# Altium schematic sheet ATMEGA328P.SchDoc
size A; SheetNumber: 4; SheetTotal: 6
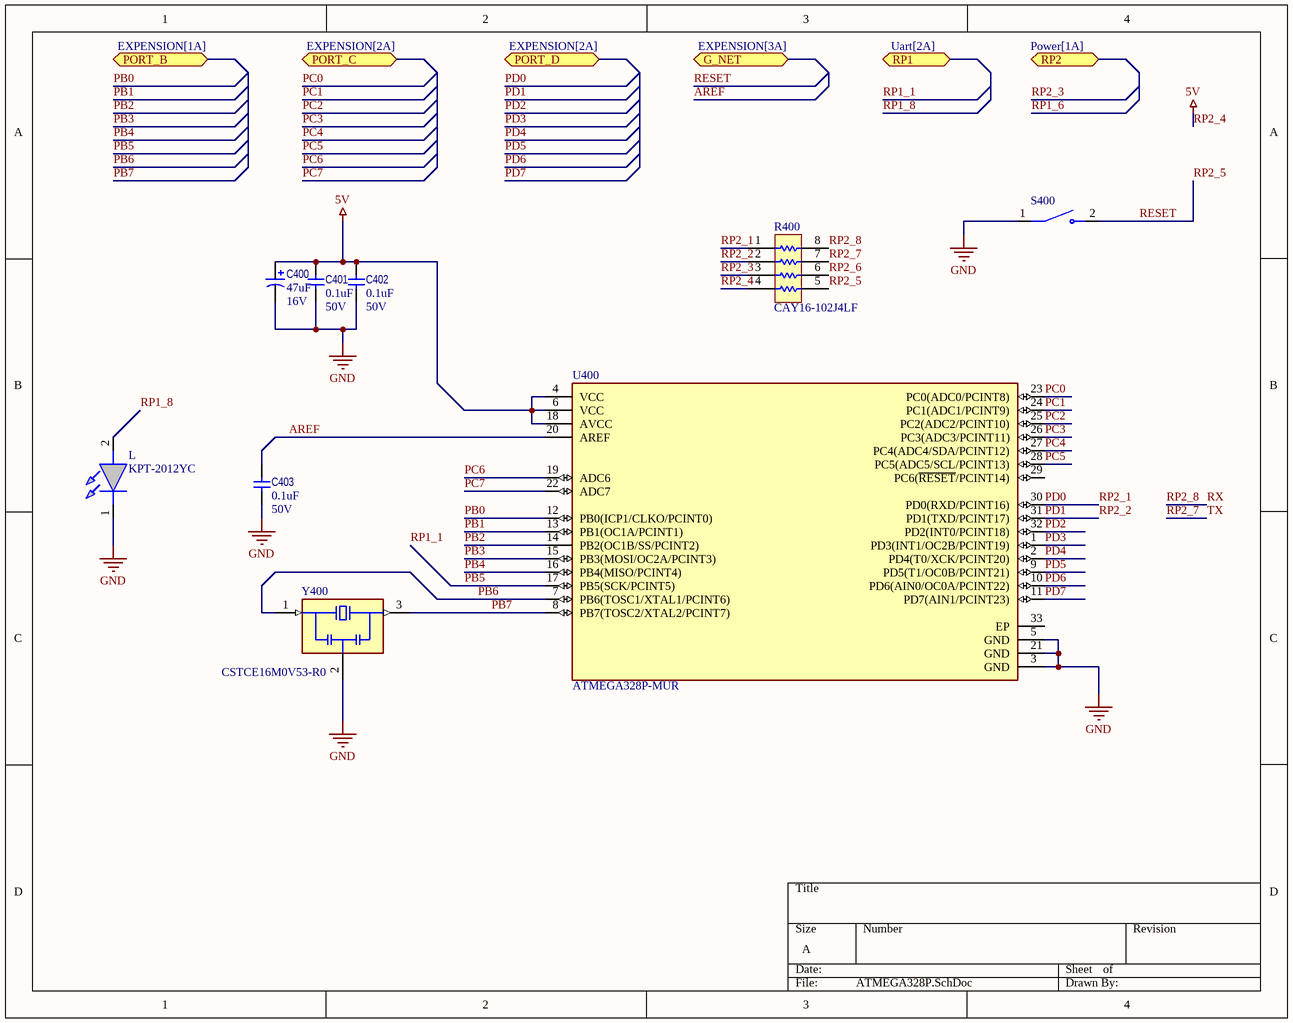
[diagram p0: ATMEGA328P.SchDoc]

## Parts
C400  Voltage_Rating: 16V  [CAPMP7343X430N]  (hidden comment: 47uF)
C401  Voltage_Rating: 50V  [CAPC1005X55N]  (hidden comment: 0.1uF)
C402  Voltage_Rating: 50V  [CAPC1005X55N]  (hidden comment: 0.1uF)
C403  Voltage_Rating: 50V  [CAPC1005X55N]  (hidden comment: 0.1uF)
L  KPT-2012YC  [LEDC2012X75N]
R400  CAY16-102J4LF  [BOUR-CAY16-J4_V]
S400  TS09-63-25-WT-160-SMT-TR  [SW_TS09-63-25-WT-160-SMT-TR]  (value not drawn)
U400  ATMEGA328P-MUR  [FP-32M1-A-IPC_C]
Y400  CSTCE16M0V53-R0  [OSC_CSTCE16M0V53-R0]

## Ports
G_NET (bidir, see EXPENSION[3A]), PORT_B (bidir, see EXPENSION[1A]), PORT_C (bidir, see EXPENSION[2A]), PORT_D (bidir, see EXPENSION[2A]), RP1 (bidir, see Uart[2A]), RP2 (bidir, see Power[1A])

## Nets
GND: C400.2 C401.2 C402.2 C403.2 L.1(K) S400.1 U400.3(GND) U400.5(GND) U400.21(GND) Y400.2(GND)
RP2_4: C400.1 C401.1 C402.1 R400.4 U400.4(VCC) U400.6(VCC) U400.18(AVCC)  [also labelled 5V]
AREF: C403.1 U400.20(AREF)
PB0: U400.12(PB0(ICP1/CLKO/PCINT0))
PB1: U400.13(PB1(OC1A/PCINT1))
PB2: U400.14(PB2(OC1B/SS/PCINT2))
PB3: U400.15(PB3(MOSI/OC2A/PCINT3))
PB4: U400.16(PB4(MISO/PCINT4))
PB5: U400.17(PB5(SCK/PCINT5))  [also labelled RP1_1]
PB6: U400.7(PB6(TOSC1/XTAL1/PCINT6)) Y400.1(IN)
PB7: U400.8(PB7(TOSC2/XTAL2/PCINT7)) Y400.3(OUT)
PC0: U400.23(PC0(ADC0/PCINT8))
PC1: U400.24(PC1(ADC1/PCINT9))
PC2: U400.25(PC2(ADC2/PCINT10))
PC3: U400.26(PC3(ADC3/PCINT11))
PC4: U400.27(PC4(ADC4/SDA/PCINT12))
PC5: U400.28(PC5(ADC5/SCL/PCINT13))
PC6: U400.19(ADC6)
PC7: U400.22(ADC7)
PD0: R400.1 U400.30(PD0(RXD/PCINT16))  [also labelled RP2_1]
PD1: R400.2 U400.31(PD1(TXD/PCINT17))  [also labelled RP2_2]
PD2: U400.32(PD2(INT0/PCINT18))
PD3: U400.1(PD3(INT1/OC2B/PCINT19))
PD4: U400.2(PD4(T0/XCK/PCINT20))
PD5: U400.9(PD5(T1/OC0B/PCINT21))
PD6: U400.10(PD6(AIN0/OC0A/PCINT22))
PD7: U400.11(PD7(AIN1/PCINT23))
RESET: R400.5 S400.2  [also labelled RP2_5]
RP1_8: L.2(A)
RP2_3: R400.3
RP2_6: R400.6
RP2_7: R400.7  [also labelled TX]
RP2_8: R400.8  [also labelled RX]

Not connected (* = marked no-connect by the designer): U400 29(PC6(~{RESET}/PCINT14)) 33(EP)

## Library data of the parts
C400 = 30017: CAP TANT 47uF ±20% 16V 2917 (7343 Metric); Part_Type: Capacitor; Manufacturer Part Number: 16TQC47MW; Manufacturer: Panasonic; Part_Status: Obsolete; ID: 30017; Updated By: rclemmons; Sorted_Value: 4.7E-5; Value: 47uF; Sub_Type: TANT; Manufacturer Part Description: CAP TANT 47uF ±20% 16V 2917 (7343 Metric); Supplier 1: DigiKey; Supplier Part Number 1: P16487TR-ND; Package_Case: 2917 (7343 Metric); RoHS: Yes; Temperature Range: -55C to +105C; Tolerance: ±20%; Created By: rclemmons; Created_Date: 2014-12-11 21:29:30; Updated_Date: 2024-02-04 20:00:42; ComponentLink1Description: Datasheet; ComponentLink1URL: https://industrial.panasonic.com/cdbs/www-data/pdf/AAA8000/AAA8000C62.pdf; ComponentLink2Description: Supplier Part Details; ComponentLink2URL: https://www.digikey.com/products/en?keywords=16TQC47MW; Symbol Ref: CAP_POL; Size / Dimension: 0.287in L x 0.169in W (7.30mm x 4.30mm); Height - Seated (Max): 0.079in (2.00mm)
C401-C403 = 30041: CAP CER 0.1uF ±10% 50V X7R 0603 (1608 Metric); Part_Type: Capacitor; Manufacturer Part Number: C0603C104K5RECAUTO; Manufacturer: KEMET; Part_Status: New; ID: 30041; Updated By: randy; Sorted_Value: 1E-7; Value: 0.1uF; Sub_Type: CER; Manufacturer Part Description: CAP CER 0.1uF ±10% 50V X7R 0603 (1608 Metric); Supplier 1: DigiKey; Supplier Part Number 1: 399-14105-2-ND; Package_Case: 0603 (1608 Metric); RoHS: Yes; Temperature Range: -55C to +125C; Dielectric: X7R; Tolerance: ±10%; Created By: randy; Created_Date: 2024-03-31 22:55:42; Updated_Date: 2024-03-31 22:57:36; ComponentLink1Description: Datasheet; ComponentLink2Description: Supplier Part Details; ComponentLink2URL: https://www.digikey.com/products/en?keywords=C0603C104K5RECAUTO; Symbol Ref: CAP_NOPOL; Size / Dimension: 0.063in L x 0.031in W (1.60mm x 0.80mm)
L = KPT-2012YC: Kingbright KPT-2012YC Yellow LED, 588 nm, 2012 (0805), Rectangle Lens SMD Package; Geometry.Height: 0.75mm; Newark Part Number: *; Newark Price/Stock: *; Manufacturer_Name: Kingbright; Manufacturer_Part_Number: KPT-2012YC; Datasheet Link: https://componentsearchengine.com/Datasheets/2/KPT-2012YC.pdf
R400 = CMP-1747-00007-1: Chip Resistor Array, 1 KOhm, +/- 5%, 62.5 mW, -55 to 125 degC, 8-Pin SMD, RoHS, Tape and Reel; Power Rating: 100 mW; Tolerance: 1%; Voltage Rating (DC): 50 V; Resistance: 330 Ohm; Case\Package: 0603; RoHSCompliant: true; Case Code (Metric): 1608; Pins: 2; PackageDescription: 8-Pin Surface Mount Device, Body 1.6 x 3.2 mm, Pitch 0.8 mm; Height: 0.45 mm; Min Operating Temperature: -55 degC; ComponentLink1URL: http://www.bourns.com/; Case Code (Imperial): 0603; Packaging: Tape and Reel; PackageReference: CAY16-J4; ComponentLink1Description: Manufacturer URL; ComponentLink2Description: Datasheet; Length: 1.6 mm; Width: 0.8 mm; Max Operating Temperature: 155 degC; Mount: Surface Mount; DatasheetVersion: Sep-14; Voltage Rating: 50 V; REACH SVHC: No SVHC; ComponentLink2URL: http://www.bourns.com/pdfs/CATCAY.pdf; Package Quantity: 5000
U400 = CMP-06276-000062-1: IC MCU 8BIT 32KB FLASH 32VQFN; Number of I/Os: 24; Core Architecture: PIC; Frequency: 20MHz; Memory Size: 3.5KB; Interface: I2C; Peripherals: Brown-out Detect/Reset; Oscillator Type: Internal; Case/Package: VQFN; Min Operating Temperature: -40°C; Packaging: Rail/Tube; Max Operating Temperature: 125°C; Memory Type: FLASH
Y400 = CSTCE16M0V53-R0: 16 MHz Ceramic Resonator Built in Capacitor 15 pF Â±0.3% -20Â°C ~ 80Â°C Surface Mount; MF: Murata; Price: None; Package: SMD-3 Murata; Purchase-URL: https://pricing.snapeda.com/search/part/CSTCE16M0V53-R0/?ref=eda; Availability: In Stock; SnapEDA_Link: https://www.snapeda.com/parts/CSTCE16M0V53-R0/Murata+Electronics+North+America/view-part/?ref=snap; Value: *; MP: CSTCE16M0V53-R0; Check_prices: https://www.snapeda.com/parts/CSTCE16M0V53-R0/Murata+Electronics+North+America/view-part/?ref=eda
S400 = TS09-63-25-WT-160-SMT-TR: Price: None; Availability: Unavailable; Package: None; Value: *; MP: TS09-63-25-WT-160-SMT-TR